# EAGLE design Qwiic_Keypad (EAGLE 9.0.0)
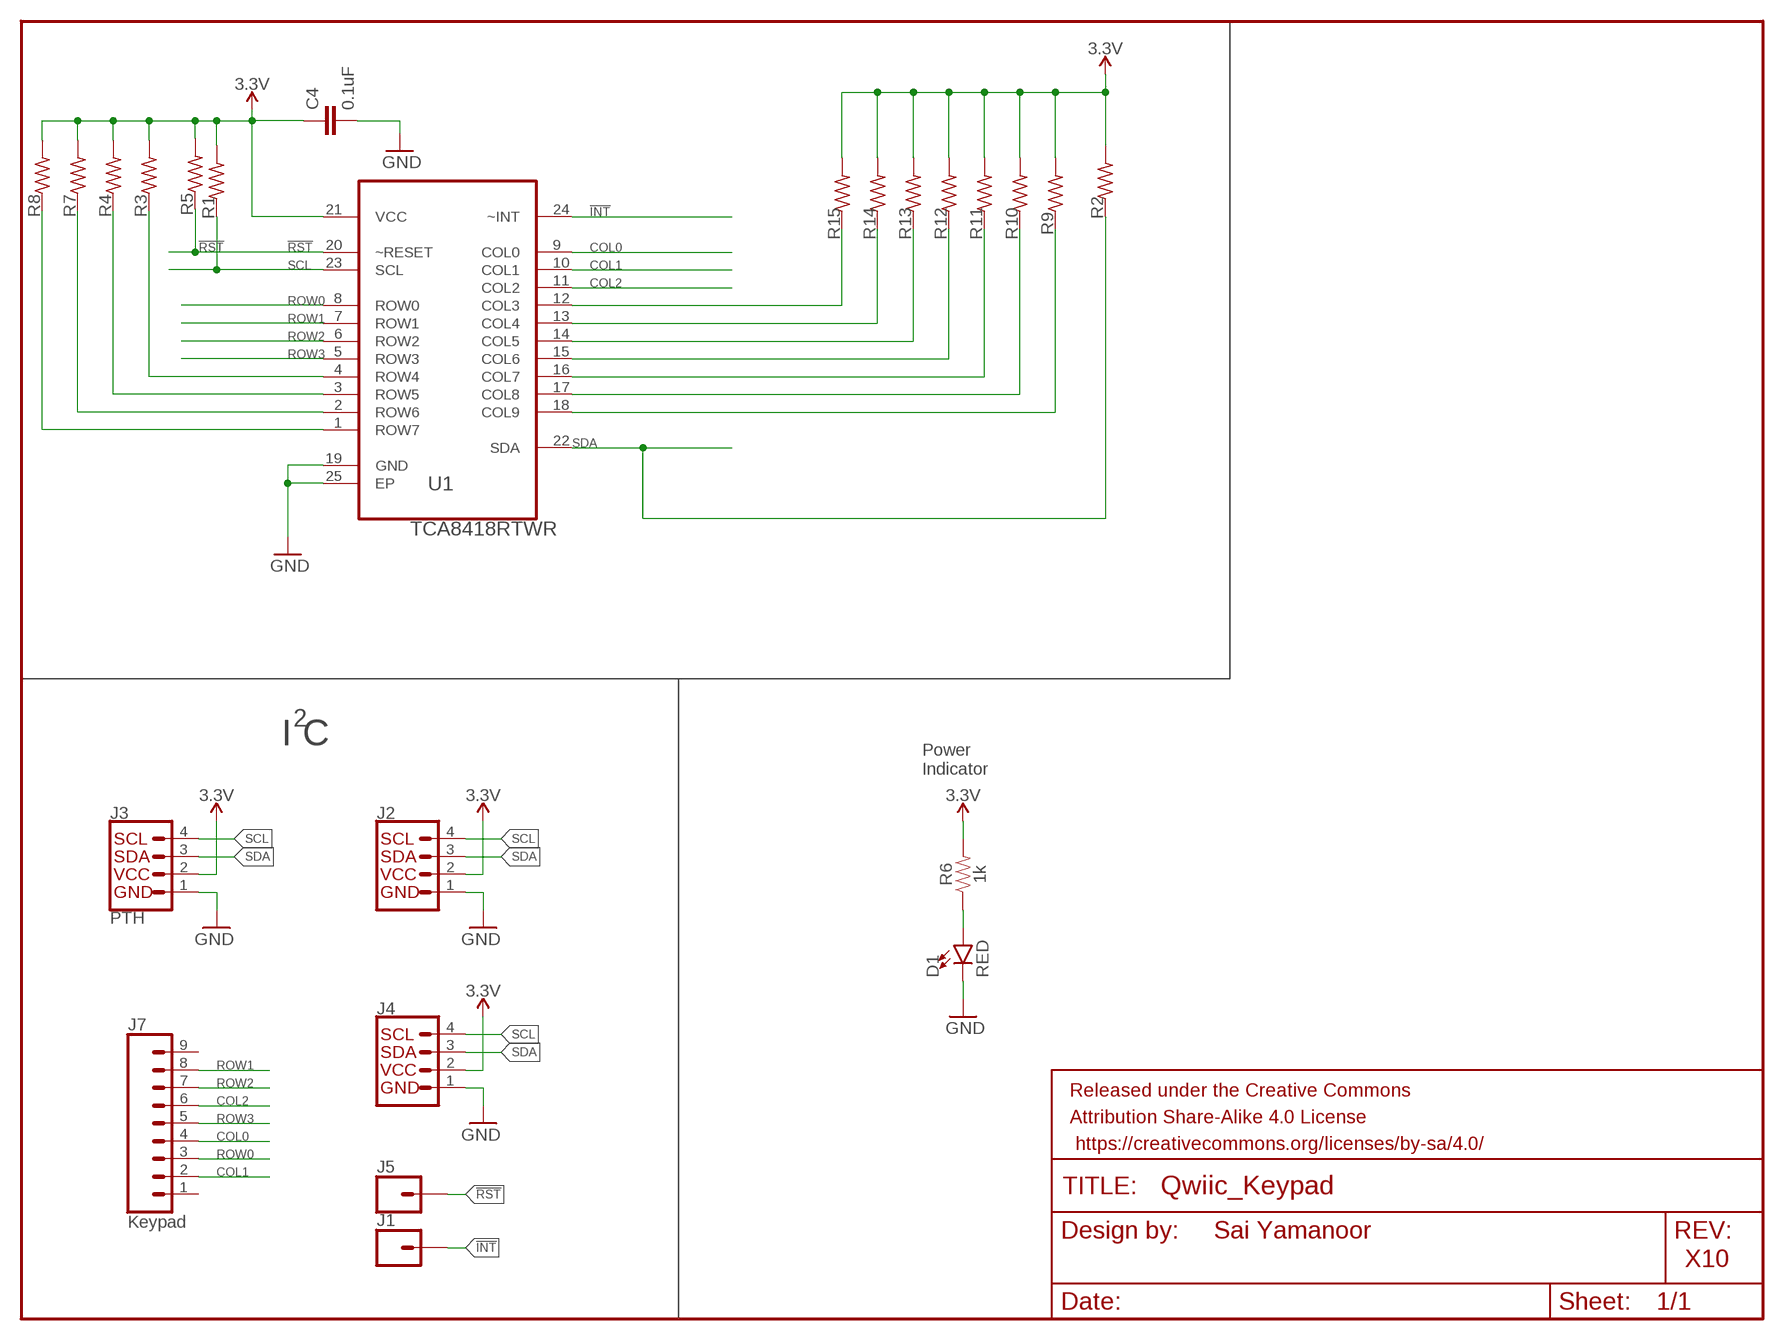
[diagram p0: schematic, sheet 1]

## Parts
C4  0.1uF  0.1UF-0603-25V-(+80/-20%)  [0603]
D1  RED  LED-RED0603  [LED-0603]
FRAME1  FRAME-LETTER  [CREATIVE_COMMONS]
J1  CONN_01PTH_NO_SILK_YES_STOP  [1X01_NO_SILK]
J2  QWIIC_CONNECTORJS-1MM  [1X04_1MM_RA]
J3  PTH  I2C_STANDARD_NO_SILK  [1X04_NO_SILK]
J4  QWIIC_CONNECTORJS-1MM  [1X04_1MM_RA]
J5  CONN_01PTH_NO_SILK_YES_STOP  [1X01_NO_SILK]
J7  Keypad  CONN_09NO_SILK  [1X09_NO_SILK]
R1  4.7k  R-US_R0402  [R0402]
R2  4.7k  R-US_R0402  [R0402]
R3  10k  R-US_R0402  [R0402]
R4  10k  R-US_R0402  [R0402]
R5  10k  R-US_R0402  [R0402]
R6  1k  1KOHM-0603-1/10W-1%  [0603]
R7  10k  R-US_R0402  [R0402]
R8  10k  R-US_R0402  [R0402]
R9  10k  R-US_R0402  [R0402]
R10  10k  R-US_R0402  [R0402]
R11  10k  R-US_R0402  [R0402]
R12  10k  R-US_R0402  [R0402]
R13  10k  R-US_R0402  [R0402]
R14  10k  R-US_R0402  [R0402]
R15  10k  R-US_R0402  [R0402]
U1  TCA8418RTWR  [QFN50P400X400X80-25N]

## Nets
3.3V: C4.1 J2.2 J3.2(VCC) J4.2 R1.2 R2.2 R3.2 R4.2 R5.2 R6.2 R7.2 R8.2 R9.2 R10.2 R11.2 R12.2 R13.2 R14.2 R15.2 U1.21(VCC)
!INT: J1.1 U1.24(~INT)
!RST: J5.1 R5.1 U1.20(~RESET)
COL0: J7.4 U1.9(COL0)
COL1: J7.2 U1.10(COL1)
COL2: J7.6 U1.11(COL2)
GND: C4.2 D1.C J2.1 J3.1(GND) J4.1 U1.19(GND) U1.25(EP)
N$1: D1.A R6.1
N$2: R3.1 U1.4(ROW4)
N$3: R4.1 U1.3(ROW5)
N$4: R7.1 U1.2(ROW6)
N$5: R8.1 U1.1(ROW7)
N$6: R15.1 U1.12(COL3)
N$7: R13.1 U1.14(COL5)
N$8: R14.1 U1.13(COL4)
N$9: R12.1 U1.15(COL6)
N$10: R11.1 U1.16(COL7)
N$11: R10.1 U1.17(COL8)
N$12: R9.1 U1.18(COL9)
ROW0: J7.3 U1.8(ROW0)
ROW1: J7.8 U1.7(ROW1)
ROW2: J7.7 U1.6(ROW2)
ROW3: J7.5 U1.5(ROW3)
SCL: J2.4 J3.4(SCL) J4.4 R1.1 U1.23(SCL)
SDA: J2.3 J3.3(SDA) J4.3 R2.1 U1.22(SDA)
Unconnected: J7.1 J7.9

## Notes on the sheet
- 2
- I C
- Power
  Indicator
- Sai Yamanoor
- X10

## Library data of the parts
C4 = SparkFun-Capacitors:0.1UF: 0.1µF ceramic capacitors A capacitor is a passive two-terminal electrical component used to store electrical energy temporarily in an electric field.; PROD_ID: CAP-00810
D1 = SparkFun-LED:LED-RED: Red SMD LED Used in manufacturing of most products at SparkFun Packages: 0603 - SMD 0603 package [Product Link] <http://docs.avagotech.com/docs/AV02-0551EN> 0603 SMART - SMD 0603 SMART package ( more efficient and expensive)[Product Link] <http://www.osram-os.com/Graphics/XPic2/00077099_0.pdf> 1206 - SMD1206 package [Product Link] <https://www.sparkfun.com/datasheets/DevTools/LilyPad/Q150OVS4.pdff> SparkFun Products: Pro Mini 328 -5V <https://www.sparkfun.com/products/821> RedBoard <https://www.sparkfun.com/products/12757> IOIO-OTG <https://www.sparkfun.com/products/13613>; PROD_ID: DIO-00819
FRAME1 = SparkFun-Aesthetics:FRAME-LETTER: Schematic Frame - Letter Standard 8.5x11 US Letter frame
J1 J5 = SparkFun-Connectors:CONN_01: Single connection point. Often used as Generic Header-pin footprint for 0.1 inch spaced/style header connections On any of the 0.1 inch spaced packages, you can populate with these: Break Away Headers - Straight <https://www.sparkfun.com/products/116> (PRT-00116) Break Away Male Headers - Right Angle <https://www.sparkfun.com/products/553> (PRT-00553) Female Headers <https://www.sparkfun.com/products/115> (PRT-00115) Break Away Headers - Machine Pin <https://www.sparkfun.com/products/117> (PRT-00117) Break Away Female Headers - Swiss Machine Pin <https://www.sparkfun.com/products/743> (PRT-00743) This device is also useful as a general connection point to wire up your design to another part of your project. Our various solder wires solder well into these plated through hole pads. Hook-Up Wire - Assortment (Stranded, 22 AWG) <https://www.sparkfun.com/products/11375> (PRT-11375) Hook-Up Wire - Assortment (Solid Core, 22 AWG) <https://www.sparkfun.com/products/11367> (PRT-11367) View the entire wire category on our website here <https://www.sparkfun.com/categories/141> Special notes: SMTSO-256-ET is a "flush mount" nut for a 4-40 screw. We mostly use this on specialty testbeds; it is a nice way to connect hardware to your PCB at an adjustable hieght. Also note, the SNAP packages are for using a snappable style connector. We sell a baggie of snaps and they are also used on two LilyPad designs: Snap Assortment - 30 pack (male and female) <https://www.sparkfun.com/products/11347> (DEV-11347) LilyPad Arduino SimpleSnap <https://www.sparkfun.com/products/10941> (DEV-10941) LilyPad SimpleSnap Protoboard <https://www.sparkfun.com/products/10940> (DEV-10940)
J2 J4 = SparkFun-Connectors:QWIIC_CONNECTOR: SparkFun I2C Standard Qwiic Connector An SMD 1mm pitch JST connector makes it easy and quick (get it? Qwiic?) to connect I2C devices to each other. The Qwiic system <http://www.sparkfun.com/qwiic> enables fast and solderless connection between popular platforms and various sensors and actuators. We carry 200mm <https://www.sparkfun.com/products/14204>, 100mm <https://www.sparkfun.com/products/14205>, 50mm <https://www.sparkfun.com/products/14206>, and breadboard friendly <https://www.sparkfun.com/products/14207> Qwiic cables. We also offer 10 pcs strips <https://www.sparkfun.com/products/14323> the SMD connectors.; PROD_ID: CONN-13694
J3 = SparkX:I2C_STANDARD: SparkFun I2C Standard Pinout Header SparkFun has standardized on a pinout for all I2C based sensor breakouts. This pinout allows I2C boards to be plugged directly into the headers on Arduino Uno compatible boards, and to be daisy chained easily. Example SparkFun Products: SparkFun Atmospheric Sensor Breakout - BME280 <https://www.sparkfun.com/products/13676> SparkFun Altitude/Pressure Sensor Breakout - MPL3115A2 <https://www.sparkfun.com/products/11084> SparkFun TOF Range Finder Sensor - VL6180 <https://www.sparkfun.com/products/12785>
J7 = SparkFun-Connectors:CONN_09: Multi connection point. Often used as Generic Header-pin footprint for 0.1 inch spaced/style header connections On any of the 0.1 inch spaced packages, you can populate with these: Break Away Headers - Straight <https://www.sparkfun.com/products/116> (PRT-00116) Break Away Male Headers - Right Angle <https://www.sparkfun.com/products/553> (PRT-00553) Female Headers <https://www.sparkfun.com/products/115> (PRT-00115) Break Away Headers - Machine Pin <https://www.sparkfun.com/products/117> (PRT-00117) Break Away Female Headers - Swiss Machine Pin <https://www.sparkfun.com/products/743> (PRT-00743) For SCREWTERMINALS and SPRING TERMINALS visit here: Screw Terimnals on SparkFun.com <https://www.sparkfun.com/search/results?term=Screw+Terminals> (5mm/3.5mm/2.54mm spacing) This device is also useful as a general connection point to wire up your design to another part of your project. Our various solder wires solder well into these plated through hole pads. Hook-Up Wire - Assortment (Stranded, 22 AWG) <https://www.sparkfun.com/products/11375> (PRT-11375) Hook-Up Wire - Assortment (Solid Core, 22 AWG) <https://www.sparkfun.com/products/11367> (PRT-11367) View the entire wire category on our website here <https://www.sparkfun.com/categories/141> Special notes: Molex polarized connector foot print use with SKU : PRT-08231 with associated crimp pins and housings. 1MM SMD Version SKU: PRT-10208 NOTES ON THE VARIANTS LOCK and LOCK_LONGPADS... This footprint was designed to help hold the alignment of a through-hole component (i.e. 6-pin header) while soldering it into place. You may notice that each hole has been shifted either up or down by 0.005 of an inch from it's more standard position (which is a perfectly straight line). This slight alteration caused the pins (the squares in the middle) to touch the edges of the holes. Because they are alternating, it causes a "brace" to hold the component in place. 0.005 has proven to be the perfect amount of "off-center" position when using our standard breakaway headers. Although looks a little odd when you look at the bare footprint, once you have a header in there, the alteration is very hard to notice. Also,if you push a header all the way into place, it is covered up entirely on the bottom side.
R1-R5 R7-R15 = resistor:R-US_: RESISTOR, American symbol
R6 = SparkFun-Resistors:1KOHM: 1kΩ resistor A resistor is a passive two-terminal electrical component that implements electrical resistance as a circuit element. Resistors act to reduce current flow, and, at the same time, act to lower voltage levels within circuits. - Wikipedia; PROD_ID: RES-07856
U1 = TCA8418RTWR:TCA8418RTWR: I2C CONTROLLED KEYPAD SCAN IC; AVAILABILITY: Good; DESCRIPTION: I2C Controlled Keypad Scan IC 24-Pin WQFN EP T/R; MF: Texas Instruments; MP: TCA8418RTWR; PACKAGE: WQFN-24 Texas Instruments; PRICE: 0.95 USD

## Board
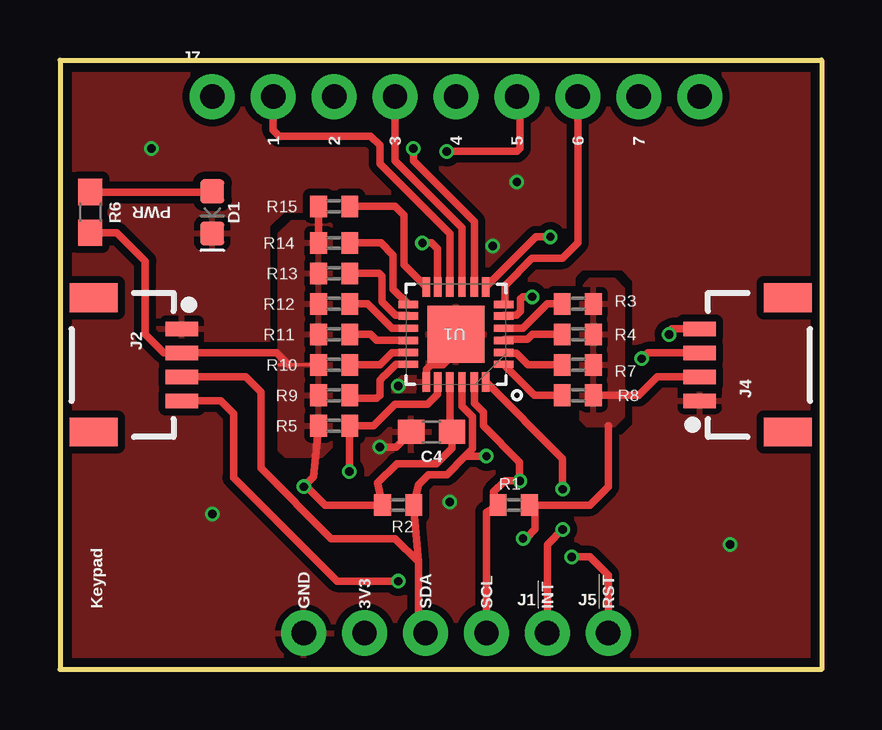
[diagram p1: board, top side]
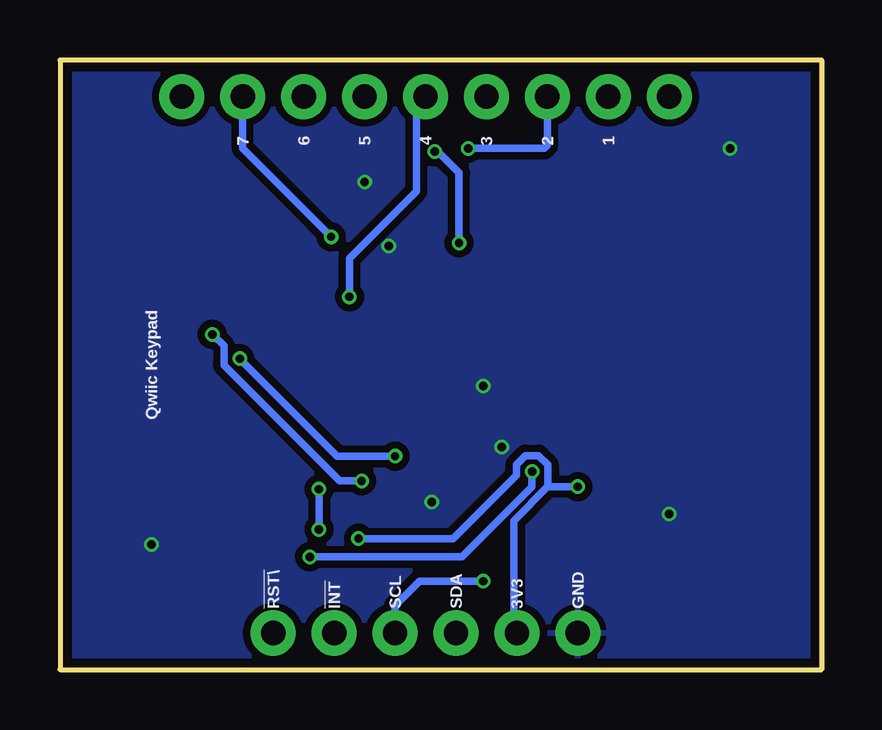
[diagram p2: board, bottom side, seen from below]

Size 31.75 x 25.4 mm. Coordinates in mm from the lower left corner, seen from the top.
Outline: 0,25.4 31.75,25.4 31.75,0 0,0 0,25.4
Copper layers (1*16): Top 0.035559375mm / dielectric 1.6mm / Bottom 0.035559375mm
Design rules "oshpark-2layer": minimum track width 6mil, minimum drill 10mil, track to track 6mil, track to pad 6mil, pad to pad 6mil, via to via 6mil, smd to smd 6mil, copper to edge 15mil, drill to drill 6mil, minimum pad ring 5mil, minimum via ring 5mil, stop-mask expansion 2.5mil, vias tented up to drill 0mil, thermal gap 10mil

### Footprints (pad centres in the part's own frame; a part is rotated, then mirrored left to right if it is on the bottom)
0603 = smd 1.1 x 1: 1 -0.85,0; 2 0.85,0
LED-0603 = smd 1 x 1: A -0.877,0; C 0.877,0
1X01_NO_SILK = drill 1.016 pad 1.88: 1 0,0
1X04_1MM_RA = smd 0.6 x 1.35: 1 -1.5,0; 2 -0.5,0; 3 0.5,0; 4 1.5,0 | smd 1.2 x 2: NC1 2.8,-3.675; NC2 -2.8,-3.675
1X04_NO_SILK = drill 1.016 pad 1.88: 1 0,0; 2 2.54,0; 3 5.08,0; 4 7.62,0
1X09_NO_SILK = drill 1.016 pad 1.88: 1 0,0; 2 2.54,0; 3 5.08,0; 4 7.62,0; 5 10.16,0; 6 12.7,0; 7 15.24,0; 8 17.78,0; 9 20.32,0
R0402 = smd 0.7 x 0.9: 1 -0.65,0; 2 0.65,0
QFN50P400X400X80-25N = smd 0.813 x 0.305: 1 -1.981,1.245; 2 -1.981,0.762; 3 -1.981,0.254; 4 -1.981,-0.254; 5 -1.981,-0.762; 6 -1.981,-1.245; 13 1.981,-1.245; 14 1.981,-0.762; 15 1.981,-0.254; 16 1.981,0.254; 17 1.981,0.762; 18 1.981,1.245 | smd 0.305 x 0.813: 7 -1.245,-1.981; 8 -0.762,-1.981; 9 -0.254,-1.981; 10 0.254,-1.981; 11 0.762,-1.981; 12 1.245,-1.981; 19 1.245,1.981; 20 0.762,1.981; 21 0.254,1.981; 22 -0.254,1.981; 23 -0.762,1.981; 24 -1.245,1.981 | smd 2.362 x 2.362: 25 0,0

### Placement (x,y rotation side)
C4  15.49,9.91 180 top
D1  6.35,19.05 270 top
FRAME1  -16.51,-49.53 0 top  (outside the outline)
J1  20.32,1.52 0 top
J2  5.08,12.7 270 top
J3  10.16,1.52 0 top
J4  26.67,12.7 90 top
J5  22.86,1.52 0 top
J7  6.35,23.88 0 top
R1  18.92,6.86 0 top
R2  14.1,6.86 180 top
R3  21.59,15.24 0 top
R4  21.59,13.97 0 top
R5  11.43,10.16 180 top
R6  1.27,19.05 270 top
R7  21.59,12.7 0 top
R8  21.59,11.43 0 top
R9  11.43,11.43 180 top
R10  11.43,12.7 180 top
R11  11.43,13.97 180 top
R12  11.43,15.24 180 top
R13  11.43,16.51 180 top
R14  11.43,17.78 180 top
R15  11.43,19.3 180 top
U1  16.51,13.97 180 top

### Tracks (layer width: path | path; a pad name or v marks a point on that pad's centre or on a via)
3.3V  (via drill 0.35)
  Top 0.152: 9.14,12.7 9.53,12.7 R10.2 | 16.26,9.99 C4.1 | 22.48,11.3 22.61,11.43
  Top 0.305: J4.2 24.9,12.2 24.13,11.43 22.61,11.43 R8.2 | R1.2 22.1,6.86 22.86,7.62 22.86,10.16 | J3.2 13.25,1.82 | 9.53,12.7 9.03,13.2 J2.2 4.33,13.2 3.56,13.97 3.56,17.02 2.37,18.2 R6.2 | U1.21 16.26,9.99 | C4.1 16.34,9.23 15.7,8.59 14.05,8.59 13.25,7.79 R2.2 11.05,6.86 10.29,7.62 v10.16,7.62 10.58,8.04 R5.2 | R1.2 19.68,6.77 | R1.2 19.81,6.82 19.81,5.84 19.43,5.46 v19.3,5.46 | R14.2 R15.2
  Bottom 0.305: v19.3,5.46 15.37,5.46 12.72,8.11 12.72,8.53 12.34,8.91 11.79,8.91 11.41,8.53 11.41,7.63 11.42,7.62 | J3.2 12.83,1.4 12.83,6.21 11.42,7.62 | v10.16,7.62 11.42,7.62
  pour Top: 22.1,16.26 23.11,16.26 23.5,15.88 23.5,10.54 23.11,10.16 21.97,10.16 21.72,10.41 21.72,15.88
  pour Top: 9.65,18.67 11.18,18.67 11.3,18.54 11.3,9.27 10.92,8.89 9.4,8.89 9.14,9.14 9.14,18.16
!INT  (via drill 0.35)
  Top 0.305: U1.24 20.95,8.79 v20.95,7.52 20.95,7.49 | v20.95,5.84 20.32,5.21 J1.1
  Bottom 0.305: v20.95,7.52 v20.95,5.84
!RST  (via drill 0.35)
  Top 0.305: J5.1 22.86,3.94 22.1,4.7 v21.34,4.7 | v12.06,8.26 12.06,9.91 12.32,10.16 R5.1 13.08,10.16 13.97,11.05 15.31,11.05 15.75,11.48 U1.20
  Bottom 0.305: v21.34,4.7 14.99,4.7 12.06,7.62 v12.06,8.26
COL0
  Top 0.305: U1.9 16.76,18.41 13.97,21.21 J7.4
COL1
  Top 0.305: U1.10 16.26,18.16 13.34,21.08 13.34,21.84 12.95,22.23 9.14,22.23 8.89,22.48 J7.2
COL2  (via drill 0.35)
  Top 0.305: U1.11 15.75,17.53 15.49,17.78 v15.11,17.78 | v16.13,21.59 19.05,21.59 19.18,21.72 19.18,24 J7.6
  Bottom 0.305: v15.11,17.78 15.11,20.7 16,21.59 v16.13,21.59
GND  (via drill 0.35)
  Top 0.305: U1.25 16.51,13.23 15.98,12.7 15.47,12.7 15.29,12.52 15.29,12.01 U1.19 | v13.34,9.27 14.01,9.27 C4.2
  other vias: 19.05,20.32 18.03,17.65 6.35,6.48 3.81,21.72 27.94,5.21 16.26,6.99 14.1,11.81
  pour Bottom (isolate 0.305, rank 6): 0,0 0,25.4 31.75,25.4 31.75,0
  pour Top (isolate 0.305, rank 6): 0,0 0,25.4 31.75,25.4 31.75,0
N$1
  Top 0.305: R6.1 6.32,19.9 D1.A
N$2
  Top 0.305: U1.4 19.3,14.22 20.32,15.24 R3.1
N$3
  Top 0.305: U1.3 18.54,13.77 19.49,13.77 19.7,13.97 R4.1
N$4
  Top 0.305: U1.2 18.52,13.18 19.02,13.18 19.51,12.7 R7.1
N$5
  Top 0.305: U1.1 19.79,11.43 R8.1
N$6
  Top 0.305: U1.12 14.35,16.87 14.35,18.92 13.97,19.3 R15.1
N$7
  Top 0.305: U1.14 14.5,14.76 14,14.76 13.44,15.32 13.44,16.38 13.31,16.51 R13.1
N$8
  Top 0.305: U1.13 13.89,15.85 13.89,17.27 13.39,17.78 R14.1
N$9
  Top 0.305: U1.15 13.84,14.22 12.83,15.24 R12.1
N$10
  Top 0.305: U1.16 13.21,13.72 12.95,13.97 R11.1
N$11
  Top 0.305: U1.17 13.84,13.21 13.34,12.7 R10.1
N$12
  Top 0.305: U1.18 14.01,12.72 13.52,12.24 13.51,12.24 13.34,12.06 13.34,11.43 13.21,11.3 12.21,11.3 R9.1
ROW0  (via drill 0.35)
  Top 0.305: U1.8 17.27,18.67 14.73,21.21 v14.73,21.72
  Bottom 0.305: v14.73,21.72 11.56,21.72 11.43,21.84 J7.3
ROW1  (via drill 0.35)
  Top 0.305: U1.7 19.84,18.03 v20.45,18.03
  Bottom 0.305: v20.45,18.03 24.13,21.72 J7.8
ROW2
  Top 0.305: U1.6 18.54,15.27 18.54,16 19.68,17.14 20.95,17.14 21.59,17.78 J7.7
ROW3  (via drill 0.35)
  Top 0.305: v19.68,15.54 19.29,15.54 19.2,15.44 19.2,14.94 19.02,14.76 18.52,14.76 U1.5
  Bottom 0.305: v19.68,15.54 19.68,17.14 16.89,19.94 16.89,23.75 J7.5
SCL  (via drill 0.35)
  Top 0.305: J3.4 17.78,6.57 R1.1 18.07,7.41 18.54,7.87 19.17,7.87 | J4.4 25.5,14.2 25.4,14.1 v25.4,13.97 | v19.18,7.86 19.17,7.87 | U1.23 17.27,11.11 17.66,10.72 17.66,10.16 19.17,8.65 19.17,7.87 | J2.4 6.71,11.2 7.24,10.67 7.24,8 11.56,3.68 v14.1,3.68
  Bottom 0.305: v25.4,13.97 24.91,13.48 24.91,12.68 20.1,7.86 v19.18,7.86 | v14.1,3.68 16.76,3.68 17.78,2.67 J3.4
SDA  (via drill 0.35)
  Top 0.305: U1.22 16.76,10.97 17.2,10.53 17.2,9.2 16.89,8.89 | 16.89,8.89 16.13,8.13 15.37,8.13 14.95,7.71 R2.1 14.95,4.48 | J3.3 14.95,1.56 14.95,4.48 | J4.3 24.5,13.2 v24.26,12.95 | v17.78,8.89 16.89,8.89 | J2.3 7.74,12.2 8.38,11.56 8.38,8.38 11.3,5.46 13.97,5.46 14.95,4.48
  Bottom 0.305: v24.26,12.95 20.19,8.89 v17.78,8.89

### Text on the board
tPlace: 1 | 2 | 3 | 4 | 5 | 6 | 7 | PWR | Keypad | GND | 3V3 | SDA | SCL | !INT | !RST
bPlace: 1 | 2 | 3 | 4 | 5 | 6 | 7 | Qwiic Keypad | GND | 3V3 | SDA | SCL | !INT | !RST\
tDocu: Kevin Kuwata